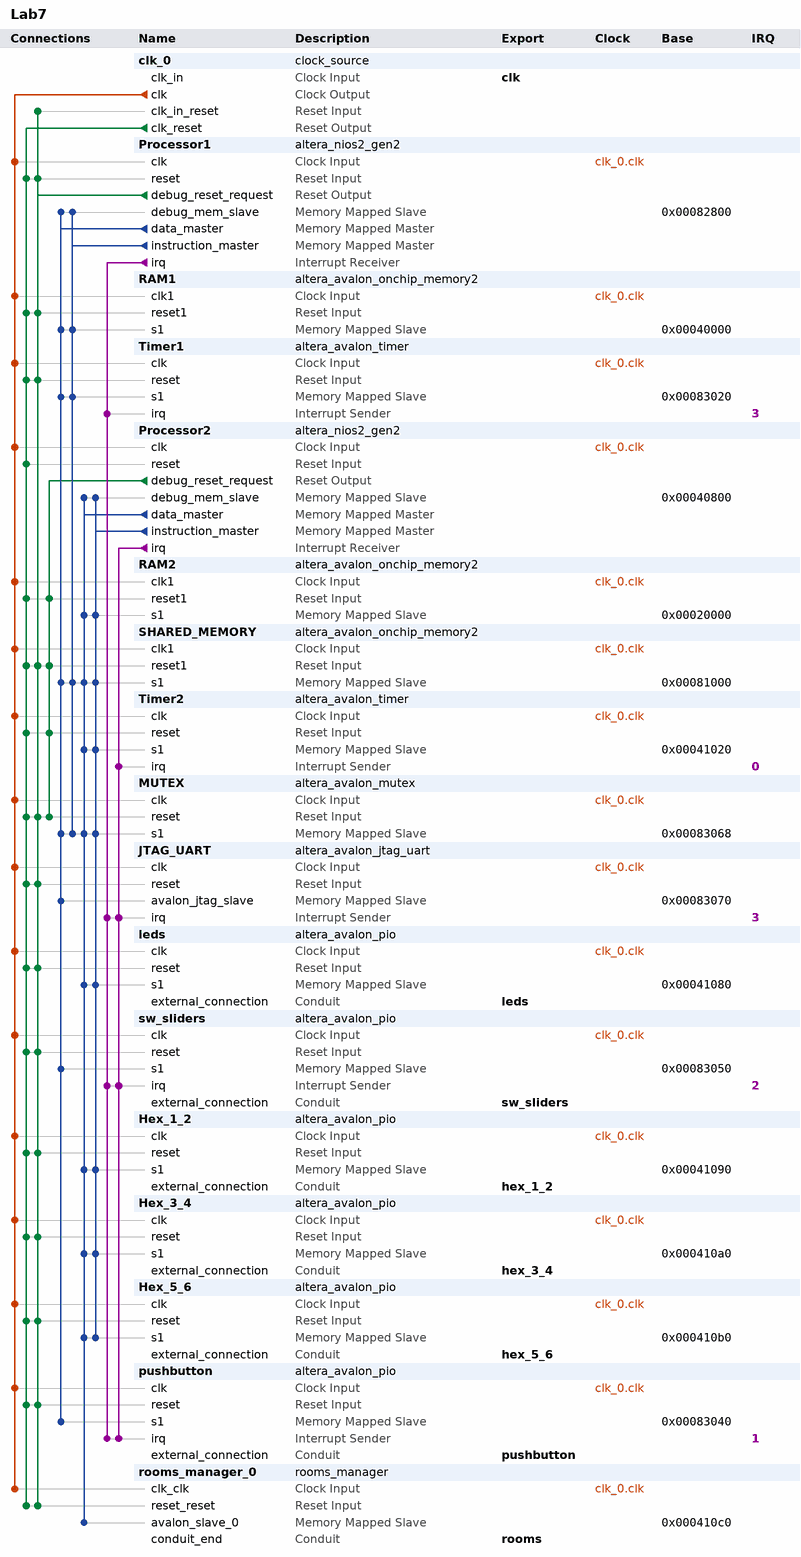
[diagram p0: system contents]
# Platform Designer (Qsys) system Lab7, Cyclone V 5CSEMA5F31C6
# Parameters at their usual value, and those the tool derives, are not listed.
package require -exact qsys 17.0
create_system Lab7
set_project_property DEVICE_FAMILY {Cyclone V}
set_project_property DEVICE 5CSEMA5F31C6

add_instance clk_0 clock_source 17.0
set_instance_parameter_value clk_0 clockFrequency 50000000

add_instance Processor1 altera_nios2_gen2 17.0
set_instance_parameter_value Processor1 dcache_size 2048
set_instance_parameter_value Processor1 exceptionSlave RAM1.s1
set_instance_parameter_value Processor1 icache_size 4096
set_instance_parameter_value Processor1 impl Tiny
set_instance_parameter_value Processor1 resetSlave RAM1.s1

add_instance RAM1 altera_avalon_onchip_memory2 17.0
set_instance_parameter_value RAM1 dataWidth 32
set_instance_parameter_value RAM1 dualPort false
set_instance_parameter_value RAM1 initMemContent true
set_instance_parameter_value RAM1 initializationFileName onchip_mem.hex
set_instance_parameter_value RAM1 memorySize 250000

add_instance Timer1 altera_avalon_timer 17.0
set_instance_parameter_value Timer1 period 1
set_instance_parameter_value Timer1 periodUnits MSEC

add_instance Processor2 altera_nios2_gen2 17.0
set_instance_parameter_value Processor2 dcache_size 2048
set_instance_parameter_value Processor2 exceptionSlave RAM2.s1
set_instance_parameter_value Processor2 icache_size 4096
set_instance_parameter_value Processor2 impl Tiny
set_instance_parameter_value Processor2 resetSlave RAM2.s1

add_instance RAM2 altera_avalon_onchip_memory2 17.0
set_instance_parameter_value RAM2 dataWidth 32
set_instance_parameter_value RAM2 dualPort false
set_instance_parameter_value RAM2 initMemContent true
set_instance_parameter_value RAM2 initializationFileName onchip_mem.hex
set_instance_parameter_value RAM2 memorySize 100000

add_instance SHARED_MEMORY altera_avalon_onchip_memory2 17.0
set_instance_parameter_value SHARED_MEMORY dataWidth 32
set_instance_parameter_value SHARED_MEMORY dualPort false
set_instance_parameter_value SHARED_MEMORY initMemContent true
set_instance_parameter_value SHARED_MEMORY initializationFileName onchip_mem.hex
set_instance_parameter_value SHARED_MEMORY memorySize 4096

add_instance Timer2 altera_avalon_timer 17.0
set_instance_parameter_value Timer2 period 1
set_instance_parameter_value Timer2 periodUnits MSEC

add_instance MUTEX altera_avalon_mutex 17.0

add_instance JTAG_UART altera_avalon_jtag_uart 17.0
set_instance_parameter_value JTAG_UART simInteractiveOptions NO_INTERACTIVE_WINDOWS

add_instance leds altera_avalon_pio 17.0
set_instance_parameter_value leds direction Output
set_instance_parameter_value leds width 10

add_instance sw_sliders altera_avalon_pio 17.0
set_instance_parameter_value sw_sliders captureEdge true
set_instance_parameter_value sw_sliders direction Input
set_instance_parameter_value sw_sliders generateIRQ true
set_instance_parameter_value sw_sliders irqType EDGE
set_instance_parameter_value sw_sliders width 10

add_instance Hex_1_2 altera_avalon_pio 17.0
set_instance_parameter_value Hex_1_2 direction Output
set_instance_parameter_value Hex_1_2 width 14

add_instance Hex_3_4 altera_avalon_pio 17.0
set_instance_parameter_value Hex_3_4 direction Output
set_instance_parameter_value Hex_3_4 width 14

add_instance Hex_5_6 altera_avalon_pio 17.0
set_instance_parameter_value Hex_5_6 direction Output
set_instance_parameter_value Hex_5_6 width 14

add_instance pushbutton altera_avalon_pio 17.0
set_instance_parameter_value pushbutton captureEdge true
set_instance_parameter_value pushbutton direction Input
set_instance_parameter_value pushbutton generateIRQ true
set_instance_parameter_value pushbutton irqType EDGE
set_instance_parameter_value pushbutton width 4

add_instance rooms_manager_0 rooms_manager 1.0

# connections
add_connection clk_0.clk Hex_1_2.clk clock
add_connection clk_0.clk Hex_3_4.clk clock
add_connection clk_0.clk Hex_5_6.clk clock
add_connection clk_0.clk JTAG_UART.clk clock
add_connection clk_0.clk leds.clk clock
add_connection clk_0.clk MUTEX.clk clock
add_connection clk_0.clk Processor1.clk clock
add_connection clk_0.clk Processor2.clk clock
add_connection clk_0.clk pushbutton.clk clock
add_connection clk_0.clk RAM1.clk1 clock
add_connection clk_0.clk RAM2.clk1 clock
add_connection clk_0.clk rooms_manager_0.clk_clk clock
add_connection clk_0.clk SHARED_MEMORY.clk1 clock
add_connection clk_0.clk sw_sliders.clk clock
add_connection clk_0.clk Timer1.clk clock
add_connection clk_0.clk Timer2.clk clock
add_connection clk_0.clk_reset Hex_1_2.reset reset
add_connection clk_0.clk_reset Hex_3_4.reset reset
add_connection clk_0.clk_reset Hex_5_6.reset reset
add_connection clk_0.clk_reset JTAG_UART.reset reset
add_connection clk_0.clk_reset leds.reset reset
add_connection clk_0.clk_reset MUTEX.reset reset
add_connection clk_0.clk_reset Processor1.reset reset
add_connection clk_0.clk_reset Processor2.reset reset
add_connection clk_0.clk_reset pushbutton.reset reset
add_connection clk_0.clk_reset RAM1.reset1 reset
add_connection clk_0.clk_reset RAM2.reset1 reset
add_connection clk_0.clk_reset rooms_manager_0.reset_reset reset
add_connection clk_0.clk_reset SHARED_MEMORY.reset1 reset
add_connection clk_0.clk_reset sw_sliders.reset reset
add_connection clk_0.clk_reset Timer1.reset reset
add_connection clk_0.clk_reset Timer2.reset reset
add_connection Processor1.debug_reset_request clk_0.clk_in_reset reset
add_connection Processor1.debug_reset_request Hex_1_2.reset reset
add_connection Processor1.debug_reset_request Hex_3_4.reset reset
add_connection Processor1.debug_reset_request Hex_5_6.reset reset
add_connection Processor1.debug_reset_request JTAG_UART.reset reset
add_connection Processor1.debug_reset_request leds.reset reset
add_connection Processor1.debug_reset_request MUTEX.reset reset
add_connection Processor1.debug_reset_request Processor1.reset reset
add_connection Processor1.debug_reset_request pushbutton.reset reset
add_connection Processor1.debug_reset_request RAM1.reset1 reset
add_connection Processor1.debug_reset_request rooms_manager_0.reset_reset reset
add_connection Processor1.debug_reset_request SHARED_MEMORY.reset1 reset
add_connection Processor1.debug_reset_request sw_sliders.reset reset
add_connection Processor1.debug_reset_request Timer1.reset reset
add_connection Processor2.debug_reset_request MUTEX.reset reset
add_connection Processor2.debug_reset_request RAM2.reset1 reset
add_connection Processor2.debug_reset_request SHARED_MEMORY.reset1 reset
add_connection Processor2.debug_reset_request Timer2.reset reset
add_connection Processor1.data_master JTAG_UART.avalon_jtag_slave avalon
set_connection_parameter_value Processor1.data_master/JTAG_UART.avalon_jtag_slave baseAddress 0x00083070
add_connection Processor1.data_master MUTEX.s1 avalon
set_connection_parameter_value Processor1.data_master/MUTEX.s1 baseAddress 0x00083068
add_connection Processor1.data_master Processor1.debug_mem_slave avalon
set_connection_parameter_value Processor1.data_master/Processor1.debug_mem_slave baseAddress 0x00082800
add_connection Processor1.data_master pushbutton.s1 avalon
set_connection_parameter_value Processor1.data_master/pushbutton.s1 baseAddress 0x00083040
add_connection Processor1.data_master RAM1.s1 avalon
set_connection_parameter_value Processor1.data_master/RAM1.s1 baseAddress 0x00040000
add_connection Processor1.data_master SHARED_MEMORY.s1 avalon
set_connection_parameter_value Processor1.data_master/SHARED_MEMORY.s1 baseAddress 0x00081000
add_connection Processor1.data_master sw_sliders.s1 avalon
set_connection_parameter_value Processor1.data_master/sw_sliders.s1 baseAddress 0x00083050
add_connection Processor1.data_master Timer1.s1 avalon
set_connection_parameter_value Processor1.data_master/Timer1.s1 baseAddress 0x00083020
add_connection Processor1.instruction_master MUTEX.s1 avalon
set_connection_parameter_value Processor1.instruction_master/MUTEX.s1 baseAddress 0x00083068
add_connection Processor1.instruction_master Processor1.debug_mem_slave avalon
set_connection_parameter_value Processor1.instruction_master/Processor1.debug_mem_slave baseAddress 0x00082800
add_connection Processor1.instruction_master RAM1.s1 avalon
set_connection_parameter_value Processor1.instruction_master/RAM1.s1 baseAddress 0x00040000
add_connection Processor1.instruction_master SHARED_MEMORY.s1 avalon
set_connection_parameter_value Processor1.instruction_master/SHARED_MEMORY.s1 baseAddress 0x00081000
add_connection Processor1.instruction_master Timer1.s1 avalon
set_connection_parameter_value Processor1.instruction_master/Timer1.s1 baseAddress 0x00083020
add_connection Processor2.data_master Hex_1_2.s1 avalon
set_connection_parameter_value Processor2.data_master/Hex_1_2.s1 baseAddress 0x00041090
add_connection Processor2.data_master Hex_3_4.s1 avalon
set_connection_parameter_value Processor2.data_master/Hex_3_4.s1 baseAddress 0x000410a0
add_connection Processor2.data_master Hex_5_6.s1 avalon
set_connection_parameter_value Processor2.data_master/Hex_5_6.s1 baseAddress 0x000410b0
add_connection Processor2.data_master leds.s1 avalon
set_connection_parameter_value Processor2.data_master/leds.s1 baseAddress 0x00041080
add_connection Processor2.data_master MUTEX.s1 avalon
set_connection_parameter_value Processor2.data_master/MUTEX.s1 baseAddress 0x00083068
add_connection Processor2.data_master Processor2.debug_mem_slave avalon
set_connection_parameter_value Processor2.data_master/Processor2.debug_mem_slave baseAddress 0x00040800
add_connection Processor2.data_master RAM2.s1 avalon
set_connection_parameter_value Processor2.data_master/RAM2.s1 baseAddress 0x00020000
add_connection Processor2.data_master rooms_manager_0.avalon_slave_0 avalon
set_connection_parameter_value Processor2.data_master/rooms_manager_0.avalon_slave_0 baseAddress 0x000410c0
add_connection Processor2.data_master SHARED_MEMORY.s1 avalon
set_connection_parameter_value Processor2.data_master/SHARED_MEMORY.s1 baseAddress 0x00081000
add_connection Processor2.data_master Timer2.s1 avalon
set_connection_parameter_value Processor2.data_master/Timer2.s1 baseAddress 0x00041020
add_connection Processor2.instruction_master Hex_1_2.s1 avalon
set_connection_parameter_value Processor2.instruction_master/Hex_1_2.s1 baseAddress 0x00041090
add_connection Processor2.instruction_master Hex_3_4.s1 avalon
set_connection_parameter_value Processor2.instruction_master/Hex_3_4.s1 baseAddress 0x000410a0
add_connection Processor2.instruction_master Hex_5_6.s1 avalon
set_connection_parameter_value Processor2.instruction_master/Hex_5_6.s1 baseAddress 0x000410b0
add_connection Processor2.instruction_master leds.s1 avalon
set_connection_parameter_value Processor2.instruction_master/leds.s1 baseAddress 0x00041080
add_connection Processor2.instruction_master MUTEX.s1 avalon
set_connection_parameter_value Processor2.instruction_master/MUTEX.s1 baseAddress 0x00083068
add_connection Processor2.instruction_master Processor2.debug_mem_slave avalon
set_connection_parameter_value Processor2.instruction_master/Processor2.debug_mem_slave baseAddress 0x00040800
add_connection Processor2.instruction_master RAM2.s1 avalon
set_connection_parameter_value Processor2.instruction_master/RAM2.s1 baseAddress 0x00020000
add_connection Processor2.instruction_master SHARED_MEMORY.s1 avalon
set_connection_parameter_value Processor2.instruction_master/SHARED_MEMORY.s1 baseAddress 0x00081000
add_connection Processor2.instruction_master Timer2.s1 avalon
set_connection_parameter_value Processor2.instruction_master/Timer2.s1 baseAddress 0x00041020
add_connection Processor1.irq JTAG_UART.irq interrupt
set_connection_parameter_value Processor1.irq/JTAG_UART.irq irqNumber 0
add_connection Processor1.irq pushbutton.irq interrupt
set_connection_parameter_value Processor1.irq/pushbutton.irq irqNumber 2
add_connection Processor1.irq sw_sliders.irq interrupt
set_connection_parameter_value Processor1.irq/sw_sliders.irq irqNumber 1
add_connection Processor1.irq Timer1.irq interrupt
set_connection_parameter_value Processor1.irq/Timer1.irq irqNumber 3
add_connection Processor2.irq JTAG_UART.irq interrupt
set_connection_parameter_value Processor2.irq/JTAG_UART.irq irqNumber 3
add_connection Processor2.irq pushbutton.irq interrupt
set_connection_parameter_value Processor2.irq/pushbutton.irq irqNumber 1
add_connection Processor2.irq sw_sliders.irq interrupt
set_connection_parameter_value Processor2.irq/sw_sliders.irq irqNumber 2
add_connection Processor2.irq Timer2.irq interrupt
set_connection_parameter_value Processor2.irq/Timer2.irq irqNumber 0

# exported interfaces
add_interface clk clock sink
set_interface_property clk EXPORT_OF clk_0.clk_in
add_interface hex_1_2 conduit end
set_interface_property hex_1_2 EXPORT_OF Hex_1_2.external_connection
add_interface hex_3_4 conduit end
set_interface_property hex_3_4 EXPORT_OF Hex_3_4.external_connection
add_interface hex_5_6 conduit end
set_interface_property hex_5_6 EXPORT_OF Hex_5_6.external_connection
add_interface leds conduit end
set_interface_property leds EXPORT_OF leds.external_connection
add_interface pushbutton conduit end
set_interface_property pushbutton EXPORT_OF pushbutton.external_connection
add_interface rooms conduit end
set_interface_property rooms EXPORT_OF rooms_manager_0.conduit_end
add_interface sw_sliders conduit end
set_interface_property sw_sliders EXPORT_OF sw_sliders.external_connection

set_interconnect_requirement {$system} qsys_mm.clockCrossingAdapter HANDSHAKE
set_interconnect_requirement {$system} qsys_mm.enableEccProtection FALSE
set_interconnect_requirement {$system} qsys_mm.insertDefaultSlave FALSE
set_interconnect_requirement {$system} qsys_mm.maxAdditionalLatency 1

save_system Lab7.qsys
